# Altium schematic sheet PlusBit_PowerSupply.SchDoc
size A4; SheetNumber: 2; SheetTotal: 5
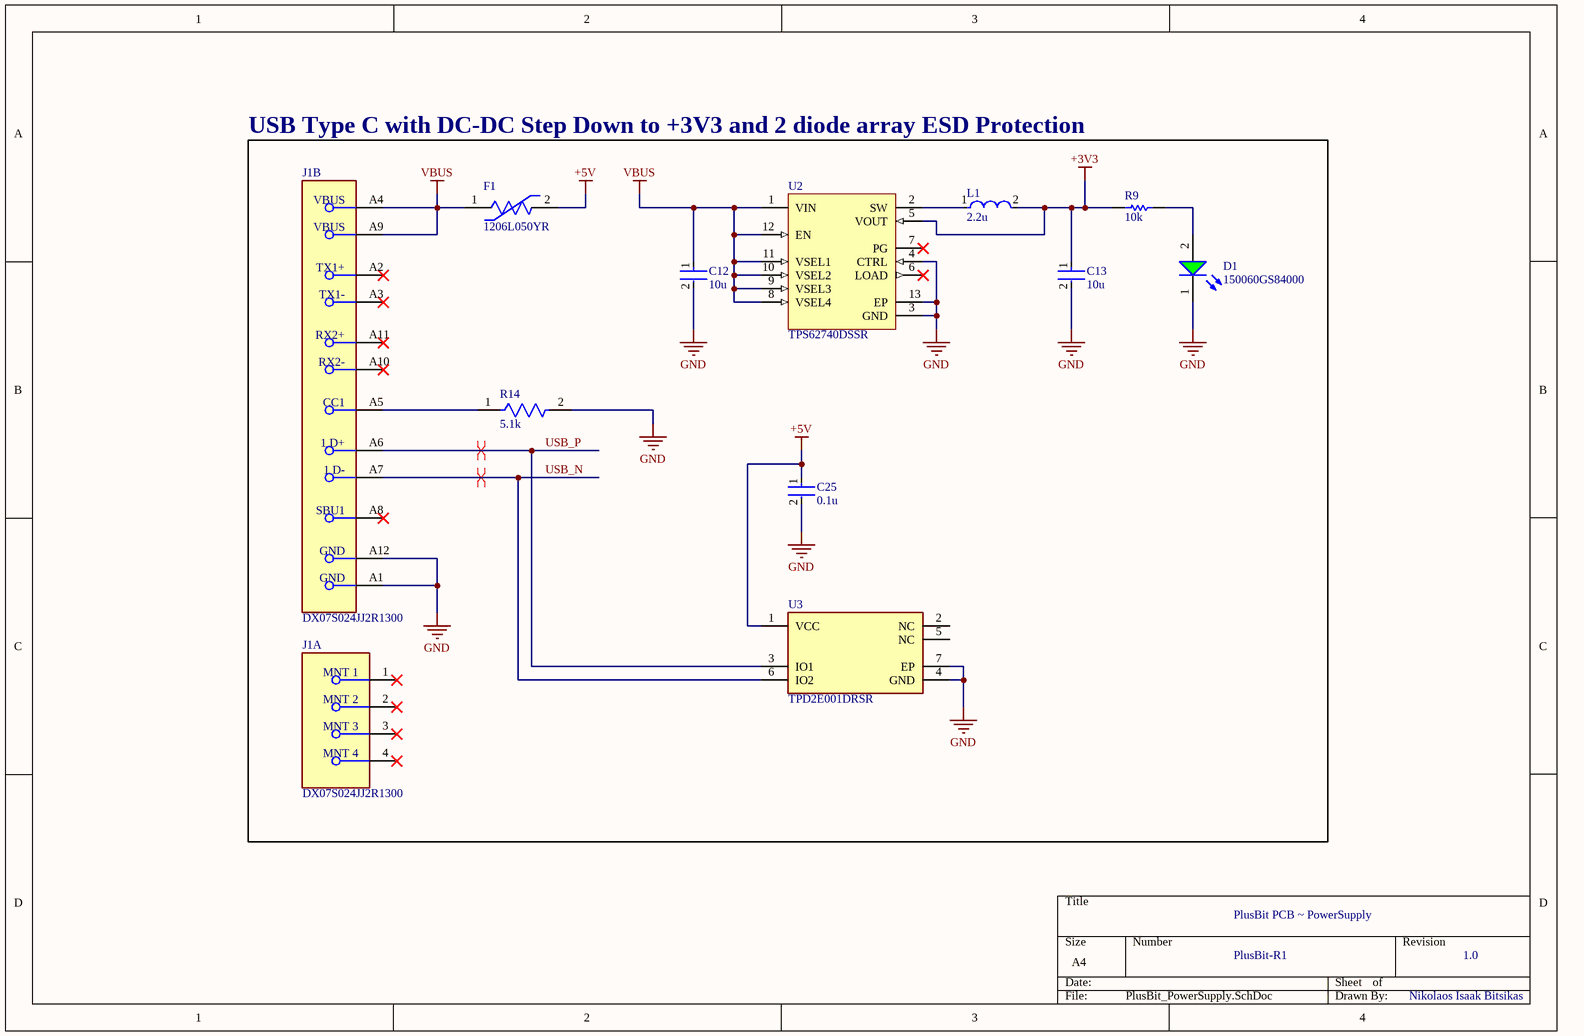
[diagram p0: PlusBit_PowerSupply.SchDoc]

## Parts
C12  10u  [FP-GRM188-0_1-e0_2_0_55-IPC_A]
C13  10u  [FP-GRM188-0_1-e0_2_0_55-IPC_A]
C25  0.1u  [FP-C0402-BB-MFG]
D1  150060GS84000  [WL-SMCW_0603_150060xx8x000]
F1  1206L050YR  [FP-1206L050YR-MFG]
J1  DX07S024JJ2R1300  [FP-DX07S024JJ2R1300-MFG]  (parts A,B of 3)
L1  2.2u  [FP-LQM2HPN_G0-IPC_C]
R9  10k  [RESC1608X55X25ML10T15]
R14  5.1k  [FP-CRCW0603-e3-IPC_C]
U2  TPS62740DSSR  [DSS0012A_V]
U3  TPD2E001DRSR  [FP-DRS0006A-MFG]

## Nets
+3V3: C13.1 L1.2 R9.2 U2.5(VOUT)
+5V: C25.1 F1.2 U3.1(VCC)
GND: C12.2 C13.2 C25.2 D1.1(K) J1.A1(GND) J1.A12(GND) R14.2 U2.3(GND) U2.4(CTRL) U2.13(EP) U3.4(GND) U3.7(EP)
VBUS: C12.1 F1.1 J1.A4(VBUS) J1.A9(VBUS) U2.1(VIN) U2.8(VSEL4) U2.9(VSEL3) U2.10(VSEL2) U2.11(VSEL1) U2.12(EN)
USB_N: J1.A7(1_D-) U3.6(IO2)
USB_P: J1.A6(1_D+) U3.3(IO1)
NetD1_2: D1.2(A) R9.1
NetJ1_A5: J1.A5(CC1) R14.1
NetL1_1: L1.1 U2.2(SW)

Not connected (* = marked no-connect by the designer): J1 1(MNT_1)* 2(MNT_2)* 3(MNT_3)* 4(MNT_4)* A2(TX1+)* A3(TX1-)* A8(SBU1)* A10(RX2-)* A11(RX2+)*; U2 6(LOAD)* 7(PG)*; U3 2(NC) 5(NC)

## Layout directives
differential pair: USB_N, USB_P

## Notes on the sheet
- USB Type C with DC-DC Step Down to +3V3 and 2 diode array ESD Protection
- PlusBit PCB ~ PowerSupply
- PlusBit-R1
- 1.0
- Nikolaos Isaak Bitsikas

## Library data of the parts
C12 C13 = CMP-2006-02792-2: Chip Multilayer Ceramic Capacitors for General Purpose, 0603, 10uF, X5R, 15%, 20%, 6.3V; Packaging: Tape and Reel; Voltage Rating (DC): 6.3V; Width: 0.031inch; Termination: SMD/SMT; Dielectric: X5R; Package Quantity: 4000; Voltage Rating: 6.3V; Capacitance: 10uF; Case/Package: 0603; Min Operating Temperature: -55°C; Voltage: 6.3V; Length: 1.6mm; Thickness: 0.035inch; Lead Free: Lead Free; Depth: 0.8mm; Case Code (Imperial): 0603; Max Operating Temperature: 85°C; Material: Ceramic; Height: 0.8mm; Tolerance: 20%; Mount: Surface Mount; REACH SVHC: No SVHC; Radiation Hardening: No; Case Code (Metric): 1608
C25 = CMP-2008-02108-2: CAP CER 0.1UF 16V X7R 0402; Manufacturer: Kemet; Manufacturer Part Number: C0402C104K4RACTU; Value: 0.10 μF; Tolerance: 0.1; Material: Ceramic; Temperature Coefficient: 15%; Voltage Rating: 16 V; Package: C0402-BB; Automotive: No; Ipc Land Pattern Name: CAPC10050X50; Device Class L3: Ceramic Capacitors; Capacitance: 0.10 μF; Octopart: https://octopart.com/c0402c104k4ractu-kemet-94158; Temperature Characteristic: X7R; Mouser Description: Cap Ceramic 0.1uF 16V X7R 10% SMD 0402 125?C Paper T/R - Tape and Reel (Alt: C0402C104K4RAC TU); ComponentLink2Description: Datasheet; Temperature Range Low: -55°C; RoHS: TRUE; Device Class L1: Passive Components; Temperature Range High: +125°C; Device Class L2: Capacitors; ComponentLink2URL: https://content.kemet.com/datasheets/KEM_C1002_X7R_SMD.pdf; Category: Cap; Height: 0.55mm; Temperature: -55°C to +125°C; Lead Free: Yes; Digikey Description: CAP CER 0.1UF 16V X7R 0402
D1 = CMP-03913-108242102-2: WL-SMCW SMT Mono-color Chip LED Waterclear; Forward Voltage: 3.3V; Dominant Wavelength: 525nm; Max Reverse Voltage (DC): 5V; Viewing Angle: 40°; Luminous Intensity: 3cd; Peak Wavelength: 520nm; Forward Current: 30mA; Length: 1.6mm; Height: 950µm; Max Operating Temperature: 85°C; Min Operating Temperature: -40°C; RoHS: Compliant; Width: 800µm
F1 = CMP-08606-000073-1: PTC RESET FUSE 6V 500MA 1206; Trip Current: 1A; Current Rating: 100A; Resistance: 700mR; Approvals: cULus; Max Power Dissipation: 600mW; Time to Trip: 0.1s; Hold Current: 500mA; Min Operating Temperature: -40°C; Voltage Rating (DC): 6V; Working Voltage: 6V; Package Quantity: 4000; Termination: SMD/SMT; Lead Free: Lead Free; REACH SVHC: No SVHC; Series: 1206L; Max Voltage Rating (DC): 6V; Height: 0.75mm; Terminal Material: Copper; Packaging: Tape and Reel; Case Code (Imperial): 1206; Length: 3.4mm; RoHS Compliant: Yes; Operating Supply Voltage: 6V; Case Code (Metric): 3216; Width: 1.8mm; Max Current Rating: 100A; Case/Package: 1206; Power Dissipation: 600mW; Max Operating Temperature: 85°C; Voltage Rating: 6V
J1 = CMP-19038-000004-1: CONN RCP USB3.1 TYPEC 24P SMD RA; Number of Contacts: 24; Gender: Receptacle; Connector Type: USB; Features: Shielded; Packaging: Tape and Reel; Mount: Surface Mount; RoHS Compliant: Yes
L1 = CMP-1662-00028-2: Multilayer Type Inductor for Power Lines, 1008 (2520), 2.2μH, 20%, 0.1Ω, 1.3A; Core Material: Ferrite; DC Resistance (DCR): 100mR; Inductance: 2.2uH; Test Frequency: 1MHz; Self Resonant Frequency: 40MHz; Shielding: Shielded; Depth: 2.2mm; Length: 2.5mm; Max DC Current: 1.3A; Military Standard: Not; Current Rating: 1.3A; Termination: SMD/SMT; Radiation Hardening: No; Tolerance: 20%; Height: 1.2mm; Case Code (Metric): 2520; DC Current: 1.3A; Inductance Tolerance: 20%; Packaging: Tape and Reel; Width: 2mm; REACH SVHC: No SVHC; Mount: Surface Mount; Max Operating Temperature: 125°C; Lead Free: Lead Free; Case/Package: 1008; Case Code (Imperial): 1008; Series: LQM2HP_G0; Height - Seated (Max): 0.039inch; Package Quantity: 3000; Min Operating Temperature: -55°C
R9 = CMP-2000-05022-1: Resistor, 10 KOhm, +/- 5%, 100 mW, -55 to 155 degC, 0603 (1608 Metric), RoHS, Tape and Reel; Manufacturer: Yageo; Resistance: 10kOhms; Voltage Rating: 50V; Temperature Coefficient: 100PPM/C; Power Rating: 100mW; Package Reference: 603; Series: RC; Case Code - mm: 1608; Packaging: Reel; Datasheet URL: http://www.farnell.com/datasheets/443971.pdf; Datasheet Version: Rev. 4, 04/2009; Operating Temperature Range: -55Cto+155C; Product: ThickFilmResistorsGeneralPurpose; Package Description: 2-Pin Surface Mount Device, Body 1.6 x 0.8 mm; Manufacturer URL: http://www.yageo.com/; Case Code - in: 0603; Tolerance: 5%; Termination Style: SMD/SMT
R14 = CMP-1012-00590-3: RES Thick Film, 5.1kΩ, 1%, 0.1W, 100ppm/°C, 0603; Power Rating: 100mW; Voltage Rating (DC): 75V; Resistance: 5.1kR; Width: 0.85mm; Depth: 0.85mm; Military Standard: Not; Package Quantity: 5000; Case Code (Metric): 1608; Length: 1.55mm; Weight: 7.1E-05oz; Packaging: Tape and Reel; Temperature Coefficient: 100ppm/°C; Case Code (Imperial): 0603; Lead Free: Lead Free; Radiation Hardening: No; Contact Plating: Tin; Composition: Thick Film; Max Operating Temperature: 155°C; Termination: SMD/SMT; Case/Package: 0603; Min Operating Temperature: -55°C; Tolerance: 1%; Voltage Rating: 75V; Mount: Surface Mount; Height: 0.45mm
U2 = CMP-0323-00572-2: Step Down Converter For Low Power Applications, 2.2 to 5.5 V VIN, -40 to 85 degC, 12-Pin WSON (DSS), RoHS, Tape and Reel; VOUT Max: 3.3 V; VIN Min: 2.2 V; VIN Max: 5.5 V; VOUT Min: 1.8 V; ComponentLink1URL: http://www.ti.com/; PackageReference: DSS0012A; ComponentLink2URL: http://www.ti.com/lit/ds/symlink/tps62740.pdf; Packing: Tape and Reel; DatasheetVersion: SLVSB02B; ComponentLink3Description: Package Specification; Temperature Max: 85 degC; RoHS: TRUE; PartNumber: TPS62740; PackageVersion: 4209244/C, 07/2011; PackageDescription: 12-Pin Plastic Small Outline, Body 3 x 2 mm, Pitch 0.5 mm; Mounting Technology: Surface Mount; ComponentLink1Description: Manufacturer URL; Temperature Min: -40 degC; ComponentLink2Description: Datasheet; ComponentLink3URL: http://www.ti.com/litv/pdf/mpds336b
U3 = CMP-0326-00040-4: TVS DIODE 5.5V 6SON; Capacitance: 1.5pF; Clamping Voltage: 105.5V; Min Breakdown Voltage: 11V; Element Configuration: Dual; Test Current: 10mA; Power Line Protection: Yes; Number of Bidirectional Channels: 2; Interface: LVDS; Leakage Current: 1nA; Direction: Unidirectional; REACH SVHC: No SVHC; Operating Supply Voltage: 5.5V; Contact Plating: Gold; Min Operating Temperature: -40°C; Max Operating Temperature: 85°C; Length: 3mm; Termination: SMD/SMT; Radiation Hardening: No; Reverse Standoff Voltage: 5.5V; ESD Protection: Yes; Package Quantity: 1; Number of Pins: 6; Height: 0.55mm; Width: 1.3mm; Packaging: Tape and Reel; Max Reverse Leakage Current: 1nA; Number of Channels: 2; Depth: 3mm; Lead Free: Lead Free; RoHS Compliant: Yes